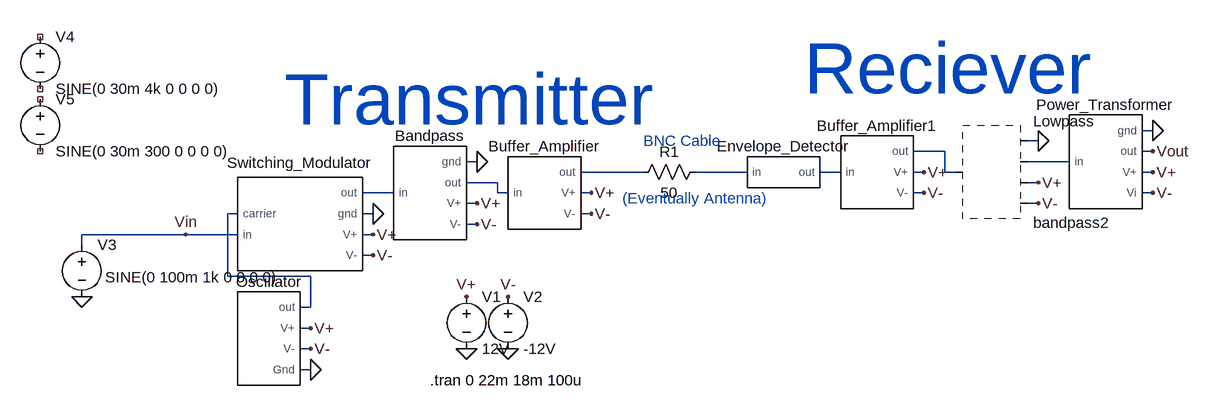
[diagram p0: schematic Final Project.asc]
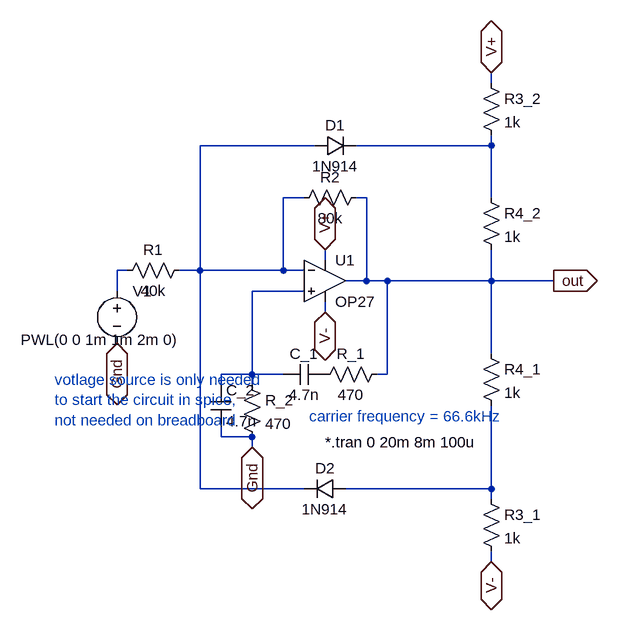
[diagram p1: sub-circuit oscillator_block.asc]
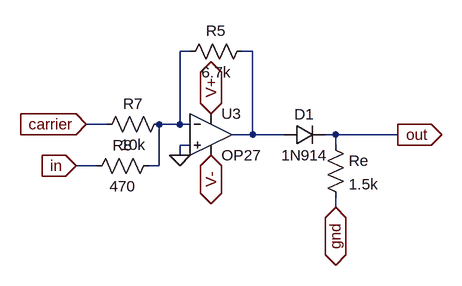
[diagram p2: sub-circuit switching_modulator.asc]
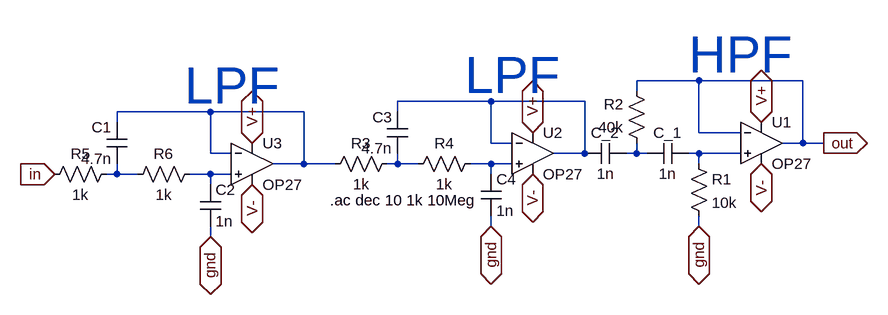
[diagram p3: sub-circuit bandpass.asc]
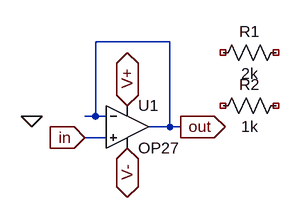
[diagram p4: sub-circuit buffer_amplifier.asc]
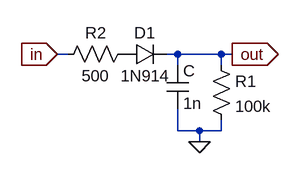
[diagram p5: sub-circuit envelope_detector.asc]
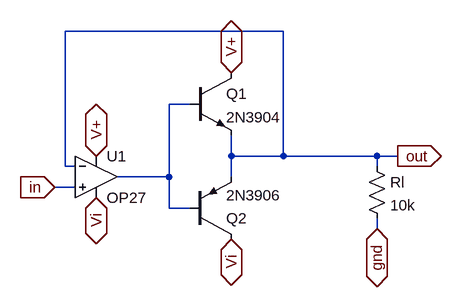
[diagram p6: sub-circuit power_transformer.asc]
Final Project.asc, the LTspice schematic file:
Version 4.1
SHEET 1 1824 680
WIRE 1584 -144 1568 -144
WIRE 1408 -128 1392 -128
WIRE 1264 -112 1216 -112
WIRE 1584 -112 1568 -112
WIRE 544 -96 528 -96
WIRE 1456 -96 1392 -96
WIRE 800 -80 704 -80
WIRE 960 -80 880 -80
WIRE 1104 -80 1072 -80
WIRE 1232 -80 1216 -80
WIRE 1264 -80 1264 -112
WIRE 1280 -80 1264 -80
WIRE 1584 -80 1568 -80
WIRE 576 -64 528 -64
WIRE 1408 -64 1392 -64
WIRE 416 -48 368 -48
WIRE 576 -48 576 -64
WIRE 592 -48 576 -48
WIRE 720 -48 704 -48
WIRE 1232 -48 1216 -48
WIRE 1584 -48 1568 -48
WIRE 544 -32 528 -32
WIRE 1408 -32 1392 -32
WIRE 176 -16 160 -16
WIRE 384 -16 368 -16
WIRE 720 -16 704 -16
WIRE 544 0 528 0
WIRE 96 16 -64 16
WIRE 176 16 96 16
WIRE 384 16 368 16
WIRE -64 32 -64 16
WIRE 384 48 368 48
WIRE 160 80 160 -16
WIRE 288 80 160 80
WIRE 288 128 288 80
WIRE 288 128 272 128
WIRE 288 160 272 160
WIRE 288 192 272 192
WIRE 288 224 272 224
FLAG 288 192 V-
FLAG 288 160 V+
FLAG 384 -16 0
FLAG 384 16 V+
FLAG 384 48 V-
FLAG 544 -96 0
FLAG 544 -32 V+
FLAG 544 0 V-
FLAG 96 16 Vin
FLAG 1408 -128 0
FLAG 1584 -144 0
FLAG 1408 -32 V-
FLAG 1584 -48 V-
FLAG 1408 -64 V+
FLAG 1584 -80 V+
FLAG 288 224 0
FLAG 1584 -112 Vout
FLAG 720 -16 V-
FLAG 720 -48 V+
FLAG 592 112 V-
FLAG 528 112 V+
FLAG 528 192 0
FLAG 592 192 0
FLAG -64 112 0
FLAG 1232 -48 V-
FLAG 1232 -80 V+
SYMBOL oscillator_block 224 176 R0
SYMATTR InstName Oscillator
SYMBOL switching_modulator 272 0 R0
WINDOW 0 0 -79 Bottom 2
SYMATTR InstName Switching_Modulator
SYMBOL voltage 528 96 R0
SYMATTR InstName V1
SYMATTR Value 12V
SYMBOL voltage 592 96 R0
SYMATTR InstName V2
SYMATTR Value -12V
SYMBOL voltage -64 16 R0
WINDOW 3 36 66 Left 2
WINDOW 123 0 0 Left 0
WINDOW 39 0 0 Left 0
SYMATTR Value SINE(0 100m 1k 0 0 0 0)
SYMATTR InstName V3
SYMBOL bandpass 464 -48 R0
SYMATTR InstName Bandpass
SYMBOL buffer_amplifier 640 -48 R0
SYMATTR InstName Buffer_Amplifier
SYMBOL envelope_detector 1008 -80 R0
SYMATTR InstName Envelope_Detector
SYMBOL power_transformer 1504 -96 R0
SYMATTR InstName Power_Transformer
SYMBOL bandpass2 1328 -80 R0
SYMATTR InstName Lowpass
SYMBOL res 784 -64 R270
WINDOW 0 32 56 VTop 2
WINDOW 3 0 56 VBottom 2
SYMATTR InstName R1
SYMATTR Value 50
SYMBOL buffer_amplifier 1152 -80 R0
SYMATTR InstName Buffer_Amplifier1
SYMBOL voltage -128 -304 R0
SYMATTR InstName V4
SYMATTR Value SINE(0 30m 4k 0 0 0 0)
SYMBOL voltage -128 -208 R0
SYMATTR InstName V5
SYMATTR Value SINE(0 30m 300 0 0 0 0)
TEXT 800 -128 Left 2 ;BNC Cable
TEXT 1048 -240 Left 7 ;Reciever
TEXT 248 -192 Left 7 ;Transmitter
TEXT 768 -40 Left 2 ;(Eventually Antenna)
TEXT 472 240 Left 2 !.tran 0 22m 18m 100u

oscillator_block.asc, the sub-circuit schematic file:
Version 4.1
SHEET 1 948 680
WIRE 480 -144 480 -160
WIRE 208 -48 32 -48
WIRE 480 -48 480 -64
WIRE 480 -48 272 -48
WIRE 192 32 160 32
WIRE 288 32 272 32
WIRE 480 32 480 -48
WIRE 224 128 224 112
WIRE -80 144 -96 144
WIRE 32 144 32 -48
WIRE 32 144 0 144
WIRE 160 144 160 32
WIRE 160 144 32 144
WIRE 192 144 160 144
WIRE 288 160 288 32
WIRE 288 160 256 160
WIRE 320 160 288 160
WIRE 480 160 480 112
WIRE 480 160 320 160
WIRE 576 160 480 160
WIRE -96 176 -96 144
WIRE 192 176 112 176
WIRE 224 208 224 192
WIRE 480 272 480 160
WIRE 112 304 112 176
WIRE 112 304 64 304
WIRE 160 304 112 304
WIRE 320 304 320 160
WIRE 320 304 304 304
WIRE 64 320 64 304
WIRE 112 320 112 304
WIRE 64 400 64 384
WIRE 112 400 64 400
WIRE 112 416 112 400
WIRE 32 480 32 144
WIRE 192 480 32 480
WIRE 480 480 480 352
WIRE 480 480 256 480
WIRE 480 496 480 480
WIRE 480 592 480 576
FLAG 576 160 out
IOPIN 576 160 Out
FLAG 224 112 V+
IOPIN 224 112 BiDir
FLAG 480 -160 V+
IOPIN 480 -160 BiDir
FLAG 224 208 V-
IOPIN 224 208 BiDir
FLAG 480 592 V-
IOPIN 480 592 BiDir
FLAG 112 416 Gnd
IOPIN 112 416 BiDir
FLAG -96 256 Gnd
IOPIN -96 256 BiDir
SYMBOL res -96 160 R270
WINDOW 0 32 56 VTop 2
WINDOW 3 0 56 VBottom 2
SYMATTR InstName R1
SYMATTR Value 40k
SYMBOL res 176 48 R270
WINDOW 0 32 56 VTop 2
WINDOW 3 0 56 VBottom 2
SYMATTR InstName R2
SYMATTR Value 80k
SYMBOL cap 160 320 R270
WINDOW 0 32 32 VTop 2
WINDOW 3 0 32 VBottom 2
SYMATTR InstName C_1
SYMATTR Value 4.7n
SYMBOL res 208 320 R270
WINDOW 0 32 56 VTop 2
WINDOW 3 0 56 VBottom 2
SYMATTR InstName R_1
SYMATTR Value 470
SYMBOL res 96 304 R0
SYMATTR InstName R_2
SYMATTR Value 470
SYMBOL cap 48 320 R0
SYMATTR InstName C_2
SYMATTR Value 4.7n
SYMBOL diode 208 -32 R270
WINDOW 0 32 32 VTop 2
WINDOW 3 0 32 VBottom 2
SYMATTR InstName D1
SYMATTR Value 1N914
SYMBOL diode 256 464 R90
WINDOW 0 0 32 VBottom 2
WINDOW 3 32 32 VTop 2
SYMATTR InstName D2
SYMATTR Value 1N914
SYMBOL voltage -96 160 R0
WINDOW 3 -148 91 Left 2
WINDOW 123 0 0 Left 0
WINDOW 39 0 0 Left 0
SYMATTR Value PWL(0 0 1m 1m 2m 0)
SYMATTR InstName V1
SYMBOL res 464 -160 R0
SYMATTR InstName R3_2
SYMATTR Value 1k
SYMBOL res 464 16 R0
SYMATTR InstName R4_2
SYMATTR Value 1k
SYMBOL res 464 256 R0
SYMATTR InstName R4_1
SYMATTR Value 1k
SYMBOL res 464 480 R0
SYMATTR InstName R3_1
SYMATTR Value 1k
SYMBOL OpAmps\\OP27 224 96 R0
SYMATTR InstName U1
TEXT -192 312 Left 2 ;votlage source is only needed \nto start the circuit in spice, \nnot needed on breadboard
TEXT 224 408 Left 2 !*.tran 0 20m 8m 100u
TEXT 200 368 Left 2 ;carrier frequency = 66.6kHz

switching_modulator.asc, the sub-circuit schematic file:
Version 4.1
SHEET 1 880 1512
WIRE -432 48 -448 48
WIRE -336 48 -352 48
WIRE -560 160 -592 160
WIRE -448 160 -448 48
WIRE -448 160 -480 160
WIRE -432 160 -448 160
WIRE -336 176 -336 48
WIRE -336 176 -368 176
WIRE -288 176 -336 176
WIRE -208 176 -224 176
WIRE -112 176 -208 176
WIRE -432 192 -448 192
WIRE -208 192 -208 176
WIRE -448 208 -448 192
WIRE -576 224 -608 224
WIRE -480 224 -480 160
WIRE -480 224 -496 224
WIRE -208 288 -208 272
FLAG -112 176 out
IOPIN -112 176 Out
FLAG -208 288 gnd
IOPIN -208 288 BiDir
FLAG -400 208 V-
IOPIN -400 208 BiDir
FLAG -400 144 V+
IOPIN -400 144 BiDir
FLAG -592 160 carrier
IOPIN -592 160 In
FLAG -608 224 in
IOPIN -608 224 In
FLAG -448 208 0
SYMBOL res -224 176 R0
SYMATTR InstName Re
SYMATTR Value 1.5k
SYMBOL diode -288 192 R270
WINDOW 0 32 32 VTop 2
WINDOW 3 0 32 VBottom 2
SYMATTR InstName D1
SYMATTR Value 1N914
SYMBOL OpAmps\\OP27 -400 112 R0
SYMATTR InstName U3
SYMBOL res -448 64 R270
WINDOW 0 32 56 VTop 2
WINDOW 3 0 56 VBottom 2
SYMATTR InstName R5
SYMATTR Value 6.7k
SYMBOL res -576 176 R270
WINDOW 0 32 56 VTop 2
WINDOW 3 0 56 VBottom 2
SYMATTR InstName R7
SYMATTR Value 10k
SYMBOL res -592 240 R270
WINDOW 0 32 56 VTop 2
WINDOW 3 0 56 VBottom 2
SYMATTR InstName R8
SYMATTR Value 470

bandpass.asc, the sub-circuit schematic file:
Version 4.1
SHEET 1 880 680
WIRE 448 48 352 48
WIRE 608 48 448 48
WIRE 352 64 352 48
WIRE 128 80 -16 80
WIRE 272 80 128 80
WIRE -304 96 -448 96
WIRE -160 96 -304 96
WIRE -16 96 -16 80
WIRE -448 112 -448 96
WIRE 448 128 448 48
WIRE 512 128 448 128
WIRE 128 144 128 80
WIRE 160 144 128 144
WIRE 608 144 608 48
WIRE 608 144 576 144
WIRE 640 144 608 144
WIRE -304 160 -304 96
WIRE -272 160 -304 160
WIRE 272 160 272 80
WIRE 272 160 224 160
WIRE 352 160 352 144
WIRE 352 160 336 160
WIRE 368 160 352 160
WIRE 448 160 432 160
WIRE 512 160 448 160
WIRE -160 176 -160 96
WIRE -160 176 -208 176
WIRE -112 176 -160 176
WIRE -16 176 -16 160
WIRE -16 176 -32 176
WIRE 16 176 -16 176
WIRE 128 176 96 176
WIRE 160 176 128 176
WIRE 448 176 448 160
WIRE -448 192 -448 176
WIRE -448 192 -464 192
WIRE -416 192 -448 192
WIRE -304 192 -336 192
WIRE -272 192 -304 192
WIRE 128 192 128 176
WIRE -304 208 -304 192
WIRE 128 272 128 256
WIRE 448 272 448 256
WIRE -304 288 -304 272
FLAG 640 144 out
IOPIN 640 144 Out
FLAG 448 272 gnd
IOPIN 448 272 BiDir
FLAG 128 272 gnd
IOPIN 128 272 BiDir
FLAG 544 112 V+
IOPIN 544 112 BiDir
FLAG 192 128 V+
IOPIN 192 128 BiDir
FLAG 544 176 V-
IOPIN 544 176 BiDir
FLAG 192 192 V-
IOPIN 192 192 BiDir
FLAG -304 288 gnd
IOPIN -304 288 BiDir
FLAG -240 144 V+
IOPIN -240 144 BiDir
FLAG -240 208 V-
IOPIN -240 208 BiDir
FLAG -544 192 in
IOPIN -544 192 In
SYMBOL OpAmps\\OP27 544 80 R0
SYMATTR InstName U1
SYMBOL res 432 160 R0
SYMATTR InstName R1
SYMATTR Value 10k
SYMBOL cap 368 176 R270
WINDOW 0 32 32 VTop 2
WINDOW 3 0 32 VBottom 2
SYMATTR InstName C_1
SYMATTR Value 1n
SYMBOL cap 272 176 R270
WINDOW 0 32 32 VTop 2
WINDOW 3 0 32 VBottom 2
SYMATTR InstName C_2
SYMATTR Value 1n
SYMBOL res 368 160 R180
WINDOW 0 36 76 Left 2
WINDOW 3 36 40 Left 2
SYMATTR InstName R2
SYMATTR Value 40k
SYMBOL res -128 192 R270
WINDOW 0 32 56 VTop 2
WINDOW 3 0 56 VBottom 2
SYMATTR InstName R3
SYMATTR Value 1k
SYMBOL cap 0 160 R180
WINDOW 0 24 56 Left 2
WINDOW 3 24 8 Left 2
SYMATTR InstName C3
SYMATTR Value 4.7n
SYMBOL res 0 192 R270
WINDOW 0 32 56 VTop 2
WINDOW 3 0 56 VBottom 2
SYMATTR InstName R4
SYMATTR Value 1k
SYMBOL cap 112 192 R0
SYMATTR InstName C4
SYMATTR Value 1n
SYMBOL OpAmps\\OP27 192 96 R0
SYMATTR InstName U2
SYMBOL res -560 208 R270
WINDOW 0 32 56 VTop 2
WINDOW 3 0 56 VBottom 2
SYMATTR InstName R5
SYMATTR Value 1k
SYMBOL cap -432 176 R180
WINDOW 0 24 56 Left 2
WINDOW 3 24 8 Left 2
SYMATTR InstName C1
SYMATTR Value 4.7n
SYMBOL res -432 208 R270
WINDOW 0 32 56 VTop 2
WINDOW 3 0 56 VBottom 2
SYMATTR InstName R6
SYMATTR Value 1k
SYMBOL cap -320 208 R0
SYMATTR InstName C2
SYMATTR Value 1n
SYMBOL OpAmps\\OP27 -240 112 R0
SYMATTR InstName U3
TEXT -344 56 Left 6 ;LPF
TEXT 432 8 Left 6 ;HPF
TEXT -120 232 Left 2 !.ac dec 10 1k 10Meg
TEXT 88 40 Left 6 ;LPF

buffer_amplifier.asc, the sub-circuit schematic file:
Version 4.1
SHEET 1 880 680
WIRE 272 32 160 32
WIRE 160 144 160 32
WIRE 160 144 144 144
WIRE 176 144 160 144
WIRE 272 160 272 32
WIRE 272 160 240 160
WIRE 288 160 272 160
WIRE 176 176 144 176
FLAG 288 160 out
IOPIN 288 160 Out
FLAG 144 176 in
IOPIN 144 176 In
FLAG 208 128 V+
IOPIN 208 128 BiDir
FLAG 208 192 V-
IOPIN 208 192 BiDir
FLAG 64 144 0
SYMBOL OpAmps\\OP27 208 96 R0
SYMATTR InstName U1
SYMBOL res 336 64 R270
WINDOW 0 32 56 VTop 2
WINDOW 3 0 56 VBottom 2
SYMATTR InstName R1
SYMATTR Value 2k
SYMBOL res 448 112 R90
WINDOW 0 0 56 VBottom 2
WINDOW 3 32 56 VTop 2
SYMATTR InstName R2
SYMATTR Value 1k

envelope_detector.asc, the sub-circuit schematic file:
Version 4.1
SHEET 1 880 680
WIRE 80 112 64 112
WIRE 240 112 224 112
WIRE 304 112 240 112
WIRE 320 112 304 112
WIRE 240 128 240 112
WIRE 304 128 304 112
WIRE 240 224 240 192
WIRE 272 224 240 224
WIRE 304 224 304 208
WIRE 304 224 272 224
WIRE 272 240 272 224
FLAG 272 240 0
FLAG 64 112 in
IOPIN 64 112 In
FLAG 320 112 out
IOPIN 320 112 Out
SYMBOL diode 160 128 R270
WINDOW 0 32 32 VTop 2
WINDOW 3 0 32 VBottom 2
SYMATTR InstName D1
SYMATTR Value 1N914
SYMBOL cap 224 128 R0
SYMATTR InstName C
SYMATTR Value 1n
SYMBOL res 288 112 R0
SYMATTR InstName R1
SYMATTR Value 100k
SYMBOL res 64 128 R270
WINDOW 0 32 56 VTop 2
WINDOW 3 0 56 VBottom 2
SYMATTR InstName R2
SYMATTR Value 500

power_transformer.asc, the sub-circuit schematic file:
Version 4.1
SHEET 1 880 680
WIRE 336 64 0 64
WIRE 192 176 160 176
WIRE 256 256 256 224
WIRE 336 256 336 64
WIRE 336 256 256 256
WIRE 480 256 336 256
WIRE 512 256 480 256
WIRE 0 272 0 64
WIRE 16 272 0 272
WIRE 480 272 480 256
WIRE 160 288 160 176
WIRE 160 288 80 288
WIRE 256 288 256 256
WIRE 16 304 -16 304
WIRE 160 336 160 288
WIRE 192 336 160 336
WIRE 480 368 480 352
FLAG 256 128 V+
IOPIN 256 128 BiDir
FLAG 48 256 V+
IOPIN 48 256 BiDir
FLAG 256 384 Vi
IOPIN 256 384 BiDir
FLAG 48 320 Vi
IOPIN 48 320 BiDir
FLAG 480 368 gnd
IOPIN 480 368 BiDir
FLAG -16 304 in
IOPIN -16 304 In
FLAG 512 256 out
IOPIN 512 256 Out
SYMBOL OpAmps\\OP27 48 224 R0
SYMATTR InstName U1
SYMBOL npn 192 128 R0
SYMATTR InstName Q1
SYMATTR Value 2N3904
SYMBOL pnp 192 384 M180
SYMATTR InstName Q2
SYMATTR Value 2N3906
SYMBOL res 464 256 R0
SYMATTR InstName Rl
SYMATTR Value 10k

The netlist it stands for:
* Final Project.asc
X§Oscillator V- 0 N008 V+ oscillator_block
X§Switching_Modulator N008 Vin 0 N007 V+ V- switching_modulator
V1 V+ 0 12V
V2 V- 0 -12V
V3 Vin 0 SINE(0 100m 1k 0 0 0 0)
X§Bandpass N007 0 N006 V+ V- bandpass
X§Buffer_Amplifier N006 N003 V+ V- buffer_amplifier
X§Envelope_Detector N004 N005 envelope_detector
X§Power_Transformer N002 0 Vout V+ V- power_transformer
* Lowpass: bandpass2 (symbol bandpass2 not available, pin order unknown); nets seen at it: 0, N001, N002, V+, V-
R1 N003 N004 50
X§Buffer_Amplifier1 N005 N001 V+ V- buffer_amplifier
V4 NC_01 NC_02 SINE(0 30m 4k 0 0 0 0)
V5 NC_03 NC_04 SINE(0 30m 300 0 0 0 0)

* block symbol definitions
.subckt oscillator_block V- Gnd out V+
R1 N003 N001 40k
R2 N001 out 80k
C_1 N004 P001 4.7n
R_1 P001 out 470
R_2 N004 Gnd 470
C_2 N004 Gnd 4.7n
D1 N001 N002 1N914
D2 N005 N001 1N914
V1 N003 Gnd PWL(0 0 1m 1m 2m 0)
R3_2 V+ N002 1k
R4_2 N002 out 1k
R4_1 out N005 1k
R3_1 N005 V- 1k
X§U1 N004 N001 V+ V- out OP27  ; pins In+ In- V+ V- OUT
* votlage source is only needed
* to start the circuit in spice,
* not needed on breadboard
*.tran 0 20m 8m 100u
* carrier frequency = 66.6kHz
.ends oscillator_block

.subckt switching_modulator carrier in gnd out V+ V-
Re out gnd 1.5k
D1 N002 out 1N914
X§U3 0 N001 V+ V- N002 OP27  ; pins In+ In- V+ V- OUT
R5 N001 N002 6.7k
R7 carrier N001 10k
R8 in N001 470
.ends switching_modulator

.subckt bandpass in gnd out V+ V-
X§U1 N004 out V+ V- out OP27  ; pins In+ In- V+ V- OUT
R1 N004 gnd 10k
C_1 N003 N004 1n
C_2 N001 N003 1n
R2 N003 out 40k
R3 N002 N005 1k
C3 N005 N001 4.7n
R4 N005 N006 1k
C4 N006 gnd 1n
X§U2 N006 N001 V+ V- N001 OP27  ; pins In+ In- V+ V- OUT
R5 in N007 1k
C1 N007 N002 4.7n
R6 N007 N008 1k
C2 N008 gnd 1n
X§U3 N008 N002 V+ V- N002 OP27  ; pins In+ In- V+ V- OUT
* LPF
* HPF
.ac dec 10 1k 10Meg
* LPF
.ends bandpass

.subckt buffer_amplifier in out V+ V-
X§U1 in out V+ V- out OP27  ; pins In+ In- V+ V- OUT
R1 NC_01 NC_02 2k
R2 NC_03 NC_04 1k
.ends buffer_amplifier

.subckt envelope_detector in out
D1 P001 out 1N914
C out 0 1n
R1 out 0 100k
R2 in P001 500
.ends envelope_detector

.subckt power_transformer in gnd out V+ Vi
X§U1 in out V+ Vi N001 OP27  ; pins In+ In- V+ V- OUT
Q1 V+ N001 out 0 2N3904
Q2 Vi N001 out 0 2N3906
Rl out gnd 10k
.ends power_transformer

.model D D
.lib standard.dio
.model NPN NPN
.model PNP PNP
.lib standard.bjt
* BNC Cable
* Reciever
* Transmitter
* (Eventually Antenna)
.tran 0 22m 18m 100u
.lib ADI.lib
.backanno
.end